# EAGLE design faboy_ble (EAGLE 7.7.0)
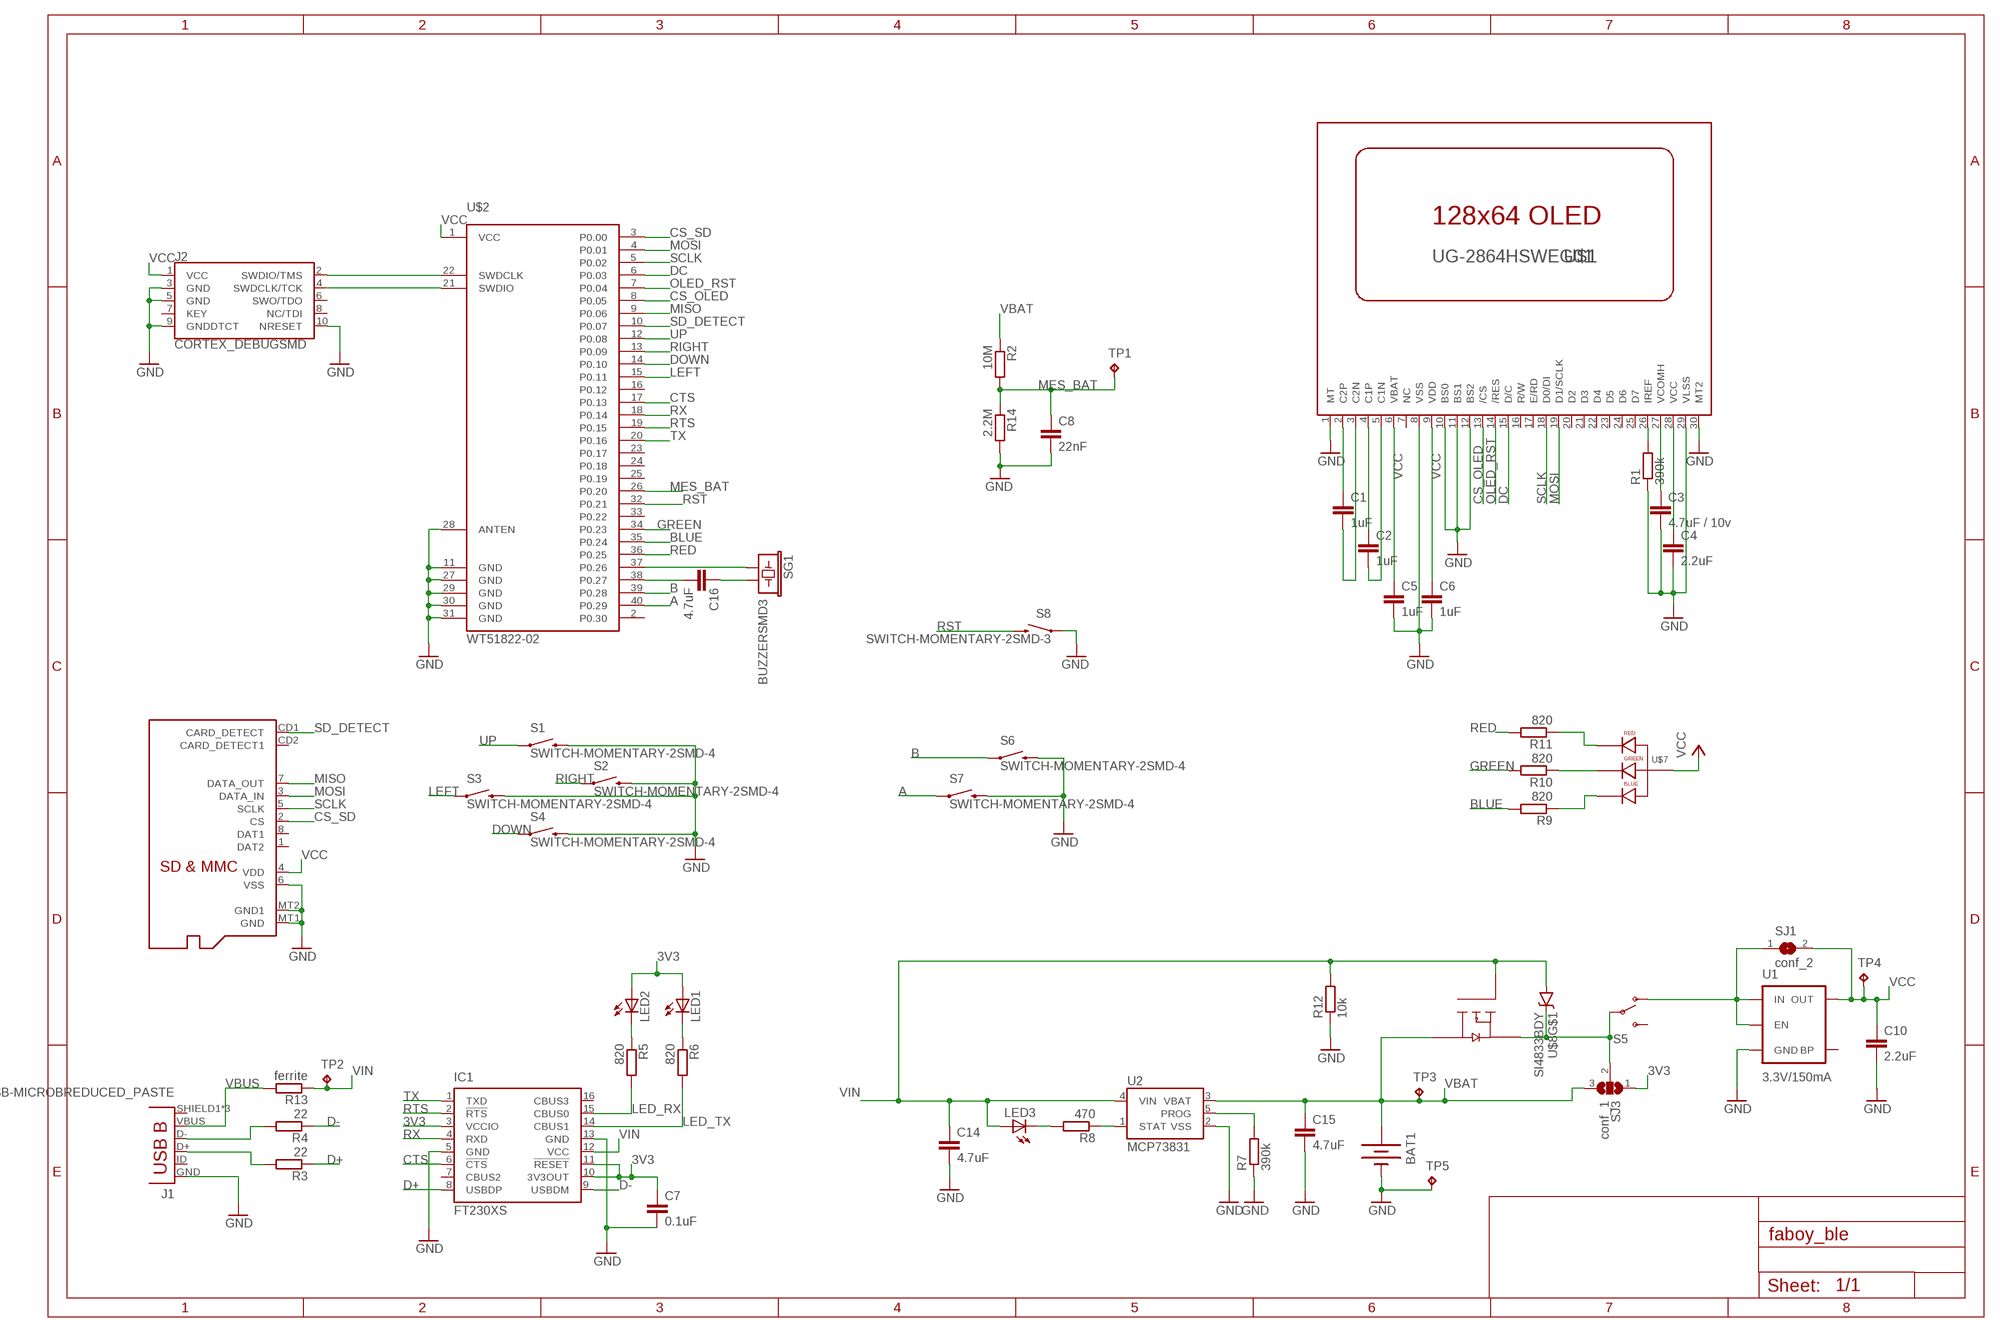
[diagram p0: schematic, sheet 1]

## Parts
BAT1  BATTERY20SMD  [BATTCON_20MM]
C1  1uF  C-EUC0805K  [C0805K]
C2  1uF  C-EUC0805K  [C0805K]
C3  4.7uF / 10v  C-EUC0805K  [C0805K]
C4  2.2uF  C-EUC0805K  [C0805K]
C5  1uF  C-EUC0805K  [C0805K]
C6  1uF  C-EUC0805K  [C0805K]
C7  0.1uF  C-EUC0805K  [C0805K]
C8  22nF  C-EUC0805K  [C0805K]
C10  2.2uF  C-EUC0805K  [C0805K]
C14  4.7uF  C-EUC0805K  [C0805K]
C15  4.7uF  C-EUC0805K  [C0805K]
C16  4.7uF  C-EUC0805K  [C0805K]
IC1  FT230XS  [SSOP16]
J1  USB-MICROBREDUCED_PASTE  [USB-B-MICRO-SMD_V03_RED_PASTE]
J2  CORTEX_DEBUGSMD  [SAMTECH_FTSH-105-01]
LED1  LEDSML0805  [SML0805]
LED2  LEDSML0805  [SML0805]
LED3  LEDSML0805  [SML0805]
R1  390k  R-EU_R0805  [R0805]
R2  10M  R-EU_R0805  [R0805]
R3  22  R-EU_R0805  [R0805]
R4  22  R-EU_R0805  [R0805]
R5  820  R-EU_R0805  [R0805]
R6  820  R-EU_R0805  [R0805]
R7  390k  R-EU_R0805  [R0805]
R8  470  R-EU_R0805  [R0805]
R9  820  R-EU_R0805  [R0805]
R10  820  R-EU_R0805  [R0805]
R11  820  R-EU_R0805  [R0805]
R12  10k  R-EU_R0805  [R0805]
R13  ferrite  R-EU_R0805  [R0805]
R14  2.2M  R-EU_R0805  [R0805]
S1  SWITCH-MOMENTARY-2SMD-4  [TACTILE_SWITCH_TALL]
S2  SWITCH-MOMENTARY-2SMD-4  [TACTILE_SWITCH_TALL]
S3  SWITCH-MOMENTARY-2SMD-4  [TACTILE_SWITCH_TALL]
S4  SWITCH-MOMENTARY-2SMD-4  [TACTILE_SWITCH_TALL]
S5  SWITCH-SPDT-SMD-A  [SWITCH-SPST-SMD-A]
S6  SWITCH-MOMENTARY-2SMD-4  [TACTILE_SWITCH_TALL]
S7  SWITCH-MOMENTARY-2SMD-4  [TACTILE_SWITCH_TALL]
S8  SWITCH-MOMENTARY-2SMD-3  [TACTILE_SWITCH_SMD-3]
SG1  BUZZERSMD3  [BUZZER-CMT1102]
SJ1  conf_2  SJ  [SJ]
SJ3  conf_1  SJ2W  [SJ_2]
TP1  TPB1,27  [B1,27]
TP2  TPB1,27  [B1,27]
TP3  TPB1,27  [B1,27]
TP4  TPB1,27  [B1,27]
TP5  TPB1,27  [B1,27]
U1  3.3V/150mA  V_REG_MIC52053.3V  [SOT23-5]
U2  MCP73831  [SOT23-5]
U$1  UG-2864HSWEG01  [1X30-0.7MM]
U$2  WT51822-02  [WT51822]
U$7  LED-RGB-P-LCC-4  [P-LCC-4-3]
U$8  SI4833BDY  [SO08]
U$9  MICROSD  [MICROSD]

## Nets
3V3: C7.1 IC1.3(VCCIO) IC1.10(3V3OUT) IC1.11(!RESET) LED1.A LED2.A SJ3.1
A: S7.A2 U$2.40(P0.29)
B: S6.A2 U$2.39(P0.28)
BLUE: R9.2 U$2.35(P0.24)
CS_OLED: U$1.13(/CS) U$2.8(P0.05)
CS_SD: U$2.3(P0.00) U$9.2(CS)
CTS: IC1.6(!CTS) U$2.17(P0.13)
D+: IC1.8(USBDP) R3.1
D-: IC1.9(USBDM) R4.1
DC: U$1.15(D/C) U$2.6(P0.03)
DOWN: S4.A2 U$2.14(P0.10)
GND: BAT1.2(-) C3.2 C4.2 C5.2 C6.2 C7.2 C8.2 C10.2 C14.2 C15.2 IC1.5(GND) IC1.13(GND) J1.GND J2.3(GND) J2.5(GND) J2.9(GNDDTCT) J2.10(NRESET) R1.1 R7.1 R12.1 R14.2 S1.B2 S2.B2 S3.B2 S4.B2 S6.B2 S7.B2 S8.1 TP5.TP U1.2(GND) U2.2(VSS) U$1.1(MT) U$1.8(VSS) U$1.10(BS0) U$1.11(BS1) U$1.12(BS2) U$1.29(VLSS) U$1.30(MT2) U$2.11(GND) U$2.27(GND) U$2.28(ANTEN) U$2.29(GND) U$2.30(GND) U$2.31(GND)
GREEN: R10.2 U$2.34(P0.23)
LED_RX: IC1.15(CBUS0) R5.2
LED_TX: IC1.14(CBUS1) R6.2
LEFT: S3.A2 U$2.15(P0.11)
MES_BAT: C8.1 R2.2 R14.1 TP1.TP U$2.26(P0.20)
MISO: U$2.9(P0.06) U$9.7(DATA_OUT)
MOSI: U$1.19(D1/SCLK) U$2.4(P0.01) U$9.3(DATA_IN)
N$1: C1.1 U$1.2(C2P)
N$2: C1.2 U$1.3(C2N)
N$3: C2.1 U$1.4(C1P)
N$4: C2.2 U$1.5(C1N)
N$5: R1.2 U$1.26(IREF)
N$6: R11.1 U$7.1(RED_CATHODE)
N$7: C3.1 U$1.27(VCOMH)
N$8: C4.1 U$1.28(VCC)
N$9: S5.1(O) SJ1.1 U1.1(IN) U1.3(EN)
N$10: C16.2 U$2.38(P0.27)
N$11: C16.1 SG1.2
N$12: J1.D+ R3.2
N$13: J1.D- R4.2
N$17: R8.1 U2.1(STAT)
N$18: LED3.C R8.2
N$19: R7.2 U2.5(PROG)
N$21: SG1.1 U$2.37(P0.26)
N$22: R10.1 U$7.4(GREEN_CATHODE)
N$23: LED2.C R5.1
N$24: R9.1 U$7.3(BLUE_CATHODE)
N$25: LED1.C R6.1
N$28: S5.2(P) SJ3.2 U$8.3(S2) U$8.7(C) U$8.8(C)
OLED_RST: U$1.14(/RES) U$2.7(P0.04)
RED: R11.2 U$2.36(P0.25)
RIGHT: S2.A2 U$2.13(P0.09)
RST: S8.4 U$2.32(P0.21)
RTS: IC1.2(!RTS) U$2.19(P0.15)
RX: IC1.4(RXD) U$2.18(P0.14)
SCLK: U$1.18(D0/DI) U$2.5(P0.02) U$9.5(SCLK)
SD_DETECT: U$2.10(P0.07) U$9.CD1(CARD_DETECT)
SWDCLK: J2.4(SWDCLK/TCK) U$2.21(SWDIO)
SWDIO: J2.2(SWDIO/TMS) U$2.22(SWDCLK)
TX: IC1.1(TXD) U$2.20(P0.16)
UP: S1.A2 U$2.12(P0.08)
VBAT: BAT1.3(+) C15.1 R2.1 SJ3.3 TP3.TP U2.3(VBAT) U$8.5(D2) U$8.6(D2)
VBUS: J1.VBUS R13.2
VCC: C5.1 C6.1 C10.1 J2.1(VCC) SJ1.2 TP4.TP U1.5(OUT) U$1.6(VBAT) U$1.9(VDD) U$2.1(VCC) U$7.2(ANODE) U$9.4(VDD)
VIN: C14.1 IC1.12(VCC) LED3.A R12.2 R13.1 TP2.TP U2.4(VIN) U$8.1(A) U$8.2(A) U$8.4(G2)
VSS: U$9.6(VSS) U$9.MT1(GND) U$9.MT2(GND1) ; supply symbol labelled GND
Unconnected: IC1.7(CBUS2) IC1.16(CBUS3) J1.ID(USBID) J1.SHIELD1(SHIELD) J1.SHIELD2(SHIELD) J1.SHIELD3(SHIELD) J2.6(SWO/TDO) J2.7(KEY) J2.8(NC/TDI) S5.3(S) U1.4(BP) U$1.7(NC) U$1.16(R/W) U$1.17(E/RD) U$1.20(D2) U$1.21(D3) U$1.22(D4) U$1.23(D5) U$1.24(D6) U$1.25(D7) U$2.2(P0.30) U$2.16(P0.12) U$2.23(P0.17) U$2.24(P0.18) U$2.25(P0.19) U$2.33(P0.22) U$9.1(DAT2) U$9.8(DAT1) U$9.CD2(CARD_DETECT1)

## Library data of the parts
BAT1 = SparkFun-Electromechanical:BATTERY: Battery Holders Various common sizes : AA, AAA, 18650 (PRT-12895), 20mm coin cell and 12mm coin cell. 20MM_4LEGS, BATT-10373
C1-C8 C10 C14-C16 = resistor:C-EU: CAPACITOR, European symbol
IC1 = ftdichip:FT230X: USB to BASIC UART IC Auto generated by make-symbol-device-package-bsdl.ulp Rev. 43 Source: Data sheet <http://www.ftdichip.com/Support/Documents/DataSheets/ICs/DS_FT230X.pdf>
J1 = SparkFun-Connectors:USB-MICROB: RED_PASTE version has 70% paste area under D+ D- USBID pins for applications where those pins aren't required, to reduce the likelihood of bridges.; PROD_ID: CONN-11752
J2 = SparkFun-Connectors:CORTEX_DEBUG: Cortex Debug Connector Datasheet <http://infocenter.arm.com/help/topic/com.arm.doc.faqs/attached/13634/cortex_debug_connectors.pdf>
LED1-LED3 = led:LED: LED OSRAM: - CHIPLED LG R971, LG N971, LY N971, LG Q971, LY Q971, LO R971, LY R971 LH N974, LH R974 LS Q976, LO Q976, LY Q976 LO Q996 - Hyper CHIPLED LW Q18S LB Q993, LB Q99A, LB R99A - SideLED LS A670, LO A670, LY A670, LG A670, LP A670 LB A673, LV A673, LT A673, LW A673 LH A674 LY A675 LS A676, LA A676, LO A676, LY A676, LW A676 LS A679, LY A679, LG A679 - Hyper Micro SIDELED® LS Y876, LA Y876, LO Y876, LY Y876 LT Y87S - SmartLED LW L88C, LW L88S LB L89C, LB L89S, LG L890 LS L89K, LO L89K, LY L89K LS L896, LA L896, LO L896, LY L896 - TOPLED LS T670, LO T670, LY T670, LG T670, LP T670 LSG T670, LSP T670, LSY T670, LOP T670, LYG T670 LG T671, LOG T671, LSG T671 LB T673, LV T673, LT T673, LW T673 LH T674 LS T676, LA T676, LO T676, LY T676, LB T676, LH T676, LSB T676, LW T676 LB T67C, LV T67C, LT T67C, LS T67K, LO T67K, LY T67K, LW E67C LS E67B, LA E67B, LO E67B, LY E67B, LB E67C, LV E67C, LT E67C LW T67C LS T679, LY T679, LG T679 LS T770, LO T770, LY T770, LG T770, LP T770 LB T773, LV T773, LT T773, LW T773 LH T774 LS E675, LA E675, LY E675, LS T675 LS T776, LA T776, LO T776, LY T776, LB T776 LHGB T686 LT T68C, LB T68C - Hyper Mini TOPLED® LB M676 - Mini TOPLED Santana® LG M470 LS M47K, LO M47K, LY M47K Source: http://www.osram.convergy.de LUXEON: - LUMILED® LXK2-PW12-R00, LXK2-PW12-S00, LXK2-PW14-U00, LXK2-PW14-V00 LXK2-PM12-R00, LXK2-PM12-S00, LXK2-PM14-U00 LXK2-PE12-Q00, LXK2-PE12-R00, LXK2-PE12-S00, LXK2-PE14-T00, LXK2-PE14-U00 LXK2-PB12-K00, LXK2-PB12-L00, LXK2-PB12-M00, LXK2-PB14-N00, LXK2-PB14-P00, LXK2-PB14-Q00 LXK2-PR12-L00, LXK2-PR12-M00, LXK2-PR14-Q00, LXK2-PR14-R00 LXK2-PD12-Q00, LXK2-PD12-R00, LXK2-PD12-S00 LXK2-PH12-R00, LXK2-PH12-S00 LXK2-PL12-P00, LXK2-PL12-Q00, LXK2-PL12-R00 Source: www.luxeon.com KINGBRIGHT: KA-3528ASYC Source: www.kingbright.com
R1-R14 = resistor:R-EU_: RESISTOR, European symbol
S1-S4 S6 S7 = SparkFun-Electromechanical:SWITCH-MOMENTARY-2: Various NO switches- pushbuttons, reed, etc; PROD_ID: SWCH-11966
S5 = SparkFun-Electromechanical:SWITCH-SPDT: SPDT Switch Simple slide switch, Spark Fun Electronics SKU : COM-00102 DPDT SMT slide switch, AYZ0202, SWCH-08179; PROD_ID: SWCH-10651
S8 = SparkFun-Electromechanical:SWITCH-MOMENTARY-2: Various NO switches- pushbuttons, reed, etc
SG1 = SparkFun-Electromechanical:BUZZER: Buzzer 12mm Spark Fun Electronics SKU : Comp-Buzzer
SJ1 = jumper:SJ: SMD solder JUMPER
SJ3 = jumper:SJ2W: SMD solder JUMPER
TP1-TP5 = testpad:TP: Test pad
U1 = SparkFun-PowerIC:V_REG_MIC5205: V_REG MIC5205 Standard 3.3V, 5V, and Adjustable 150mA LDO voltage regulator in SOT-23 layout. Micrel part MIC5205. BP (by-pass) pin is used to lower output noise with 470pF cap, may be left open. On the adjustable version BP is used to set output.; PROD_ID: VREG-00822
U2 = SparkFun-PowerIC:MCP73831: Miniature single cell, fully integrated Li-Ion, Li-polymer charge management controller http://ww1.microchip.com/downloads/en/DeviceDoc/20001984g.pdf IC-09995; PROD_ID: IC-09995
U$1 = adafruit:UG-2864HSWEG01: UG-2864HSWEG01 OLED display
U$2 = Wireless_Tag:WT51822-02
U$7 = SparkFun-LED:LED-RGB-P-LCC-4
U$8 = SparkFun-DiscreteSemi:SI4833BDY
U$9 = adafruit:MICROSD: Micro-SD / Transflash card holder with SPI pinout For the 3M # 2908-05WB-MG and/or 4UCON #19656 push-push type

## Board
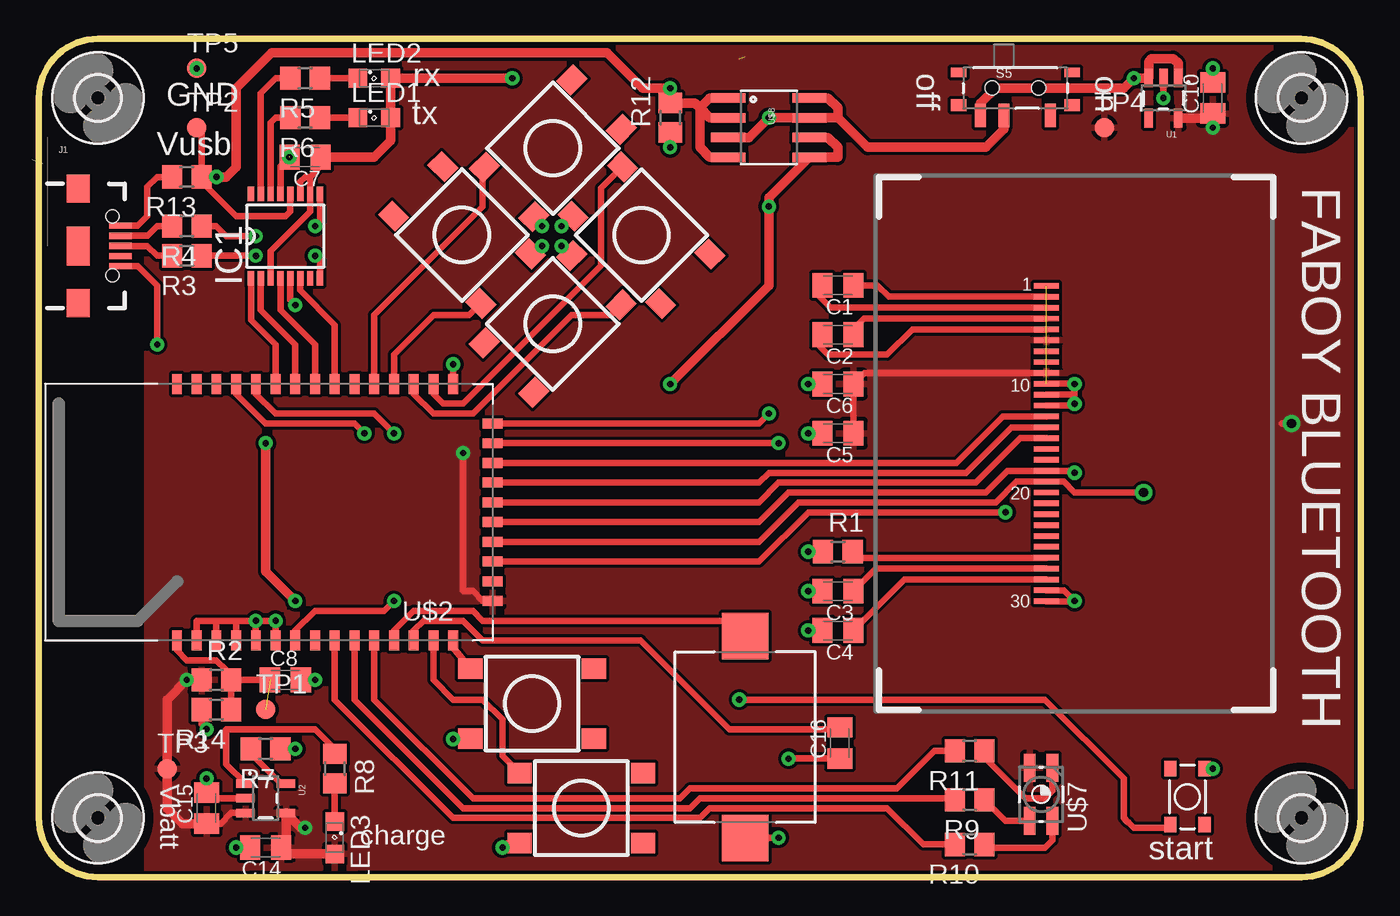
[diagram p1: board, top side]
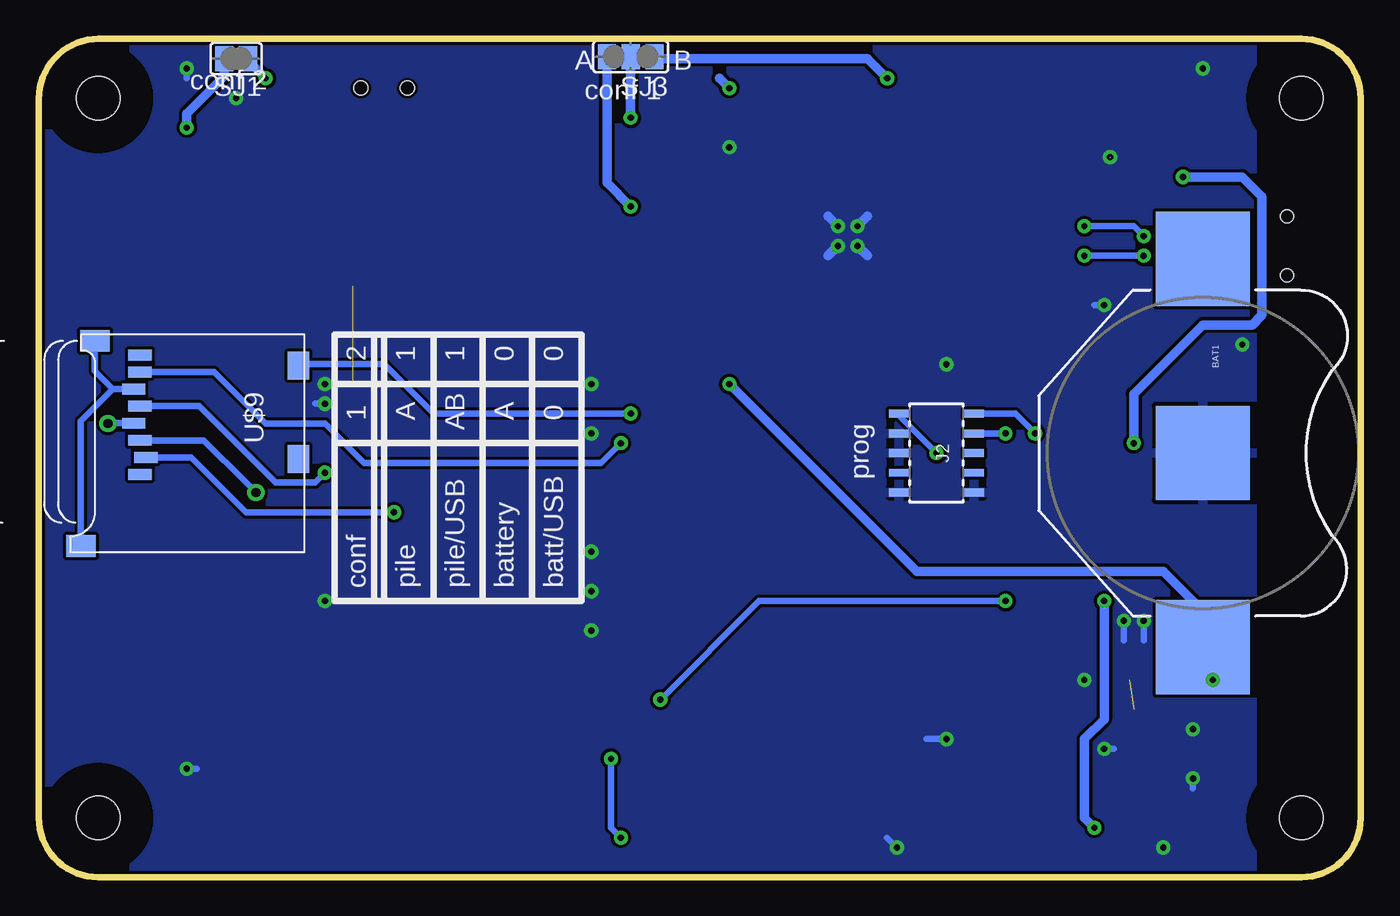
[diagram p2: board, bottom side, seen from below]

Size 85.09 x 53.98 mm. Coordinates in mm from the lower left corner, seen from the top.
Outline: 81.23,53.98 3.81,53.98 arc90 0,50.16 0,3.81 arc90 3.81,0 81.28,0 arc90 85.09,3.81 85.09,50.11 arc90 81.23,53.98
Copper layers (1*16): Top 0.035mm / dielectric 1.5mm / Bottom 0.035mm
Design rules "SparkFun": minimum track width 8mil, minimum drill 20mil, track to track 8mil, track to pad 8mil, pad to pad 8mil, via to via 8mil, smd to smd 8mil, copper to edge 8mil, drill to drill 8mil, minimum pad ring 12mil, minimum via ring 10mil, stop-mask expansion 4mil, vias tented up to drill 20mil, thermal gap 10mil

### Footprints (pad centres in the part's own frame; a part is rotated, then mirrored left to right if it is on the bottom)
BATTCON_20MM = smd 6.07 x 6.07: 1 -12.5,0; 2 0,0; 3 12.5,0
C0805K = smd 1.3 x 1.6: 1 -1,0; 2 1,0
SSOP16 = smd 0.914 x 0.406: 1 -2.718,2.223; 2 -2.718,1.587; 3 -2.718,0.953; 4 -2.718,0.318; 5 -2.718,-0.318; 6 -2.718,-0.953; 7 -2.718,-1.587; 8 -2.718,-2.223; 9 2.718,-2.223; 10 2.718,-1.587; 11 2.718,-0.953; 12 2.718,-0.318; 13 2.718,0.318; 14 2.718,0.953; 15 2.718,1.587; 16 2.718,2.223
USB-B-MICRO-SMD_V03_RED_PASTE = smd 1.45 x 0.4: D+ 2.725,0; D- 2.725,0.65; GND 2.725,-1.3; ID 2.725,-0.65; VBUS 2.725,1.3 | smd 1.5 x 1.8: SHIELD1 0,3.685; SHIELD2 0,-3.685 | smd 1.5 x 2.5: SHIELD3 0,0 | hole 0.85: 2.2,1.9; 2.2,-1.9
SAMTECH_FTSH-105-01 = smd 0.508 x 1.27: 1 -2.54,-2.413; 2 -2.54,2.413; 3 -1.27,-2.413; 4 -1.27,2.413; 5 0,-2.413; 6 0,2.413; 7 1.27,-2.413; 8 1.27,2.413; 9 2.54,-2.413; 10 2.54,2.413
SML0805 = smd 1.2 x 1.2: A 1.05,0; C -1.05,0
R0805 = smd 1.3 x 1.5: 1 -0.95,0; 2 0.95,0
TACTILE_SWITCH_TALL = smd 1.55 x 1.3: A1 -3.975,-2.25; A2 3.975,-2.25; B1 -3.975,2.25; B2 3.975,2.25
SWITCH-SPST-SMD-A = smd 0.7 x 1.5: 1 -2.25,-1.75; 2 -0.75,-1.75; 3 2.25,-1.75 | smd 1 x 0.6: GND1 -3.65,1; GND3 3.65,1 | smd 1 x 0.8: GND2 -3.65,-1.1; GND4 3.65,-1.1 | hole 0.9: -1.5,0; 1.5,0
TACTILE_SWITCH_SMD-3 = smd 1 x 0.8: 1 -1.8,1.1; 2 1.8,1.1; 3 -1.8,-1.1; 4 1.8,-1.1
BUZZER-CMT1102 = smd 3 x 3: 1 -6.5,0; 2 6.5,0
SJ = smd 1.168 x 1.6: 1 -0.762,0; 2 0.762,0
SJ_2 = smd 1.168 x 1.6: 1 -1.524,0; 2 0,0; 3 1.524,0
B1,27 = smd 1.27 x 1.27: TP 0,0
SOT23-5 = smd 0.55 x 1.2: 1 -0.95,-1.3; 2 0,-1.3; 3 0.95,-1.3; 4 0.95,1.3; 5 -0.95,1.3
1X30-0.7MM = smd 0.35 x 1.6: 1 -10.15,0; 2 -9.45,0; 3 -8.75,0; 4 -8.05,0; 5 -7.35,0; 6 -6.65,0; 7 -5.95,0; 8 -5.25,0; 9 -4.55,0; 10 -3.85,0; 11 -3.15,0; 12 -2.45,0; 13 -1.75,0; 14 -1.05,0; 15 -0.35,0; 16 0.35,0; 17 1.05,0; 18 1.75,0; 19 2.45,0; 20 3.15,0; 21 3.85,0; 22 4.55,0; 23 5.25,0; 24 5.95,0; 25 6.65,0; 26 7.35,0; 27 8.05,0; 28 8.75,0; 29 9.45,0; 30 10.15,0
WT51822 = smd 1.27 x 0.635: 1 0,13.97; 2 0,12.7; 3 0,11.43; 4 0,10.16; 5 0,8.89; 6 0,7.62; 7 0,6.35; 8 0,5.08; 9 0,3.81; 10 0,2.54 | smd 0.635 x 1.27: 11 2.54,0; 12 3.81,0; 13 5.08,0; 14 6.35,0; 15 7.62,0; 16 8.89,0; 17 10.16,0; 18 11.43,0; 19 12.7,0; 20 13.97,0; 21 15.24,0; 22 16.51,0; 23 17.78,0; 24 19.05,0; 25 20.32,0; 26 20.32,16.51; 27 19.05,16.51; 28 17.78,16.51; 29 16.51,16.51; 30 15.24,16.51; 31 13.97,16.51; 32 12.7,16.51; 33 11.43,16.51; 34 10.16,16.51; 35 8.89,16.51; 36 7.62,16.51; 37 6.35,16.51; 38 5.08,16.51; 39 3.81,16.51; 40 2.54,16.51
2,8 = hole 2.8: 0,0
P-LCC-4-3 = smd 0.75 x 1.8: 1 0.725,1.7; 2 -0.725,1.7; 3 -0.725,-1.7; 4 0.725,-1.7
SO08 = smd 0.61 x 2.21: 1 -1.905,-2.616; 2 -0.635,-2.616; 3 0.635,-2.616; 4 1.905,-2.616; 5 1.905,2.616; 6 0.635,2.616; 7 -0.635,2.616; 8 -1.905,2.616
MICROSD = smd 0.7 x 1.5: 1 9,-10.64; 2 7.9,-10.24; 3 6.8,-10.64; 4 5.7,-11.04; 5 4.6,-10.64; 6 3.5,-11.04; 7 2.4,-10.64; 8 1.3,-10.64 | smd 1.8 x 1.4: CD1 2,-0.44; CD2 8,-0.44 | smd 1.4 x 1.9: MT1 0.4,-13.54; MT2 13.6,-14.44

### Placement (x,y rotation side)
BAT1  10.16,27.3 270 bottom
C1  51.44,38.1 180 top
C2  51.44,34.92 180 top
C3  51.44,18.41 180 top
C4  51.44,15.88 180 top
C5  51.44,28.57 180 top
C6  51.44,31.75 180 top
C7  17.14,46.35 180 top
C8  15.88,12.7 0 top
C10  75.56,50.16 90 top
C14  14.61,1.91 180 top
C15  10.79,4.45 90 top
C16  51.56,8.64 90 top
IC1  15.88,41.27 90 top
J1  2.54,40.64 0 top
J2  27.3,27.3 270 bottom
LED1  21.59,48.9 0 top
LED2  21.59,51.44 0 top
LED3  19.05,2.54 270 top
R1  51.44,20.95 0 top
R2  11.43,12.7 0 top
R3  9.53,40.01 180 top
R4  9.53,41.91 180 top
R5  17.14,51.44 180 top
R6  17.14,48.9 180 top
R7  14.61,8.26 180 top
R8  19.05,6.99 270 top
R9  59.92,4.98 180 top
R10  59.92,2.11 180 top
R11  59.92,8.13 180 top
R12  40.64,48.9 90 top
R13  9.53,45.09 180 top
R14  11.43,10.79 180 top
S1  38.79,41.33 135 top
S2  33.08,35.62 45 top
S3  33.09,46.93 225 top
S4  27.24,41.34 315 top
S5  62.87,50.8 0 top
S6  34.92,4.45 180 top
S7  31.75,11.18 180 top
S8  73.94,5.18 270 top
SG1  45.47,9.02 270 top
SJ1  72.39,52.7 180 bottom
SJ3  46.99,52.83 180 bottom
TP1  14.61,10.79 0 top
TP2  10.16,48.26 0 top
TP3  8.26,6.99 0 top
TP4  68.58,48.26 0 top
TP5  10.16,52.07 0 top
U1  72.39,50.16 180 top
U2  14.61,5.08 270 top
U$1  64.87,27.91 270 top
U$2  29.21,31.75 180 top
U$3  [2,8]  81.28,50.16 270 top
U$4  [2,8]  81.28,3.81 270 top
U$5  gnd  [2,8]  3.81,50.16 270 top
U$6  [2,8]  3.81,3.81 270 top
U$7  64.52,5.33 0 top
U$8  46.99,48.26 270 top
U$9  67.94,34.92 270 bottom

### Tracks (layer width: path | path; a pad name or v marks a point on that pad's centre or on a via)
3V3  (via drill 0.4)  (1 unrouted)
  Top 0.406: IC1.11 16.83,44.77 17.14,45.09 17.46,45.09 | 17.46,45.09 IC1.10 17.46,42.86 14.92,40.32 IC1.3 | C7.1 18.14,45.77 17.46,45.09
  Top 0.61: C7.1 21.59,46.35 22.64,47.41 LED1.A LED2.A v30.48,51.44
  Bottom 0.61: v30.48,51.44 31.75,52.7 45.09,52.7 45.34,52.45
A
  Top 0.406: S7.A2 26.67,14.79 U$2.40
B
  Top 0.406: S6.A2 29.84,7.8 29.84,10.16 28.57,11.43 26.67,11.43 25.4,12.7 U$2.39
BLUE
  Top 0.406: U$2.35 20.32,11.43 27.3,4.45 41.91,4.45 42.55,5.08 58.87,5.08 R9.2
CS_OLED
  Top 0.406: U$1.13 62.05,29.66 59.05,26.67 U$2.8
CS_SD  (via drill 0.4)
  Top 0.406: U$2.3 46.35,20.32 49.53,23.5 v62.23,23.5
  Bottom 0.406: v62.23,23.5 71.75,23.5 75.28,27.02 U$9.2
CTS
  Top 0.406: IC1.6 16.83,37.78 19.05,35.56 U$2.17
D+  (via drill 0.4)
  Top 0.406: R3.1 v13.97,40.01 | v17.78,40.01 18.1,39.69 IC1.8
  Bottom 0.406: v13.97,40.01 v17.78,40.01
D-  (via drill 0.4)
  Top 0.406: v13.97,41.27 12.06,41.27 11.43,41.91 R4.1 | v17.78,41.91 18.1,42.23 IC1.9
  Bottom 0.406: v13.97,41.27 14.61,41.91 v17.78,41.91
DC
  Top 0.406: U$1.15 63.19,28.27 60.33,25.4 47.62,25.4 46.35,24.13 U$2.6
DOWN
  Top 0.406: U$2.14 22.86,33.66 25.4,36.2 27.71,36.2 S4.A2
GND  (via drill 0.4)  (3 unrouted)
  Top 0.406: IC1.13 15.56,45.77 16.13,46.34 v16.13,46.35 | C15.2 arc90 11.16,5.08 U2.2 11.43,5.08 10.79,5.71 v10.79,6.35 | C4.2 v49.53,15.88 | C3.2 v49.53,18.41 | R1.1 v49.53,20.95 | C5.2 v49.53,28.57 | U1.2 v72.39,50.16 | U$2.11 v26.67,33.02 | J1.GND 6.38,39.34 7.62,38.1 v7.62,34.29 | C14.2 v12.7,1.91 | U$1.29 65.99,18.46 v66.67,17.78 66.66,17.77 U$1.30 | S8.1 v75.56,6.98 v75.56,6.99 | U$1.10 66.66,31.77 v66.67,31.75 66.67,31.11 66.62,31.07 | U$1.12 66.56,30.36 v66.67,30.48 66.67,31.02 66.62,31.07 | U$1.11 66.62,31.07 | C10.2 v75.56,52.07 | C6.2 v49.53,31.75 | S6.B2 30.14,2.19 v29.84,1.91 | S7.B2 26.71,8.93 v26.67,8.89 | R7.1 v16.51,8.26 | R14.2 10.48,9.84 v10.79,9.53 | C8.2 v17.78,12.7 | U$2.31 v15.24,16.51 12.7,16.51 U$2.29 | U$2.30 v13.97,16.51 11.43,16.51 | U$2.27 10.16,16.51 11.43,16.51 | U$2.28 11.43,16.51 | IC1.5 16.19,37.15 v16.51,36.83
  Top 0.61: R12.1 v40.64,46.99 | S4.B2 31.87,40.12 v32.38,40.64 | S3.B2 31.87,42.43 v32.38,41.91 | S1.B2 34.3,42.55 v33.66,41.91 | S2.B2 34.27,40.02 v33.66,40.64
  Bottom 0.406: v66.67,17.78 66.04,17.78 | v75.56,6.99 74.93,6.99 | v66.67,31.75 66.04,31.75 | v66.67,30.48 67.31,30.48 | v75.56,52.07 75.56,51.44 | v49.53,31.75 50.16,31.75 | v29.84,1.91 30.48,2.54 | v26.67,8.89 27.94,8.89 | v16.51,8.26 15.88,8.26 | v10.79,6.35 10.79,5.71 | v15.24,16.51 U$2.31 | v13.97,16.51 U$2.30 | v16.51,36.83 17.14,36.83
  Bottom 0.61: v32.38,40.64 31.75,40.01 | v32.38,41.91 31.75,42.55 | v33.66,41.91 34.29,42.55 | v33.66,40.64 34.29,40.01
  other vias: 10.16,52.07
  pour Bottom: 6.99,53.98 85.09,53.98 85.09,0 6.99,0
GREEN
  Top 0.406: U$2.34 19.05,11.43 26.67,3.81 42.55,3.81 43.18,4.45 54.61,4.45 56.95,2.11 R10.2
LED_RX
  Top 0.406: IC1.15 14.29,50.48 15.24,51.44 R5.2
LED_TX
  Top 0.406: IC1.14 14.92,48.58 15.24,48.9 R6.2
LEFT
  Top 0.406: U$2.15 21.59,36.2 28.57,43.18 28.57,45.6 S3.A2
MES_BAT  (1 unrouted)
  Top 0.406: U$2.26 8.89,14.61 9.53,13.97 11.43,13.97 12.06,13.34 12.06,13.02 R2.2 | R14.1 R2.2 | C8.1 R2.2
MISO  (via drill 0.4)
  Top 0.406: U$2.9 v47.62,27.94
  Bottom 0.406: v47.62,27.94 48.9,26.67 64.14,26.67 66.67,29.21 70.48,29.21 73.8,32.52 U$9.7
MOSI  (via drill 0.6)
  Top 0.406: U$2.4 46.35,21.59 48.9,24.13 61.59,24.13 62.93,25.46 U$1.19 65.97,25.46 66.67,24.77 v71.12,24.77
  Bottom 0.406: U$9.3 74.48,28.12 71.75,25.4 v71.12,24.77
N$1
  Top 0.406: U$1.2 54.71,37.37 53.98,38.1 C1.1
N$2
  Top 0.406: U$1.3 50.97,36.66 50.16,37.47 50.16,37.83 C1.2
N$3
  Top 0.406: U$1.4 53.11,35.97 52.7,35.56 52.7,35.2 C2.1
N$4
  Top 0.406: U$1.5 56.22,35.27 54.61,33.66 50.8,33.66 50.16,34.29 50.16,34.66 C2.2 50.8,34.56
N$5
  Top 0.406: U$1.26 52.77,20.57 R1.2
N$6
  Top 0.406: U$7.1 65.24,5.55 64.77,5.08 63.5,5.08 60.96,7.62 60.96,8.04 R11.1
N$7
  Top 0.406: U$1.27 53.88,19.86 C3.1
N$8
  Top 0.406: U$1.28 55.73,19.16 C4.1
N$9  (via drill 0.4)
  Top 0.61: S5.1 60.62,49.82 61.59,50.8 69.85,50.8 v70.48,51.44 71.41,51.44 U1.3 71.44,52.52 SJ1.1 73.03,52.7 73.34,52.39 U1.1
  Bottom 0.61: SJ1.1 71.63,52.58 v70.48,51.44
N$10
  Top 0.406: U$2.38 24.13,15.88 24.77,16.51 27.3,16.51 28.57,15.24 38.73,15.24 44.45,9.53 51.45,9.53 C16.2
N$11  (via drill 0.4)
  Top 0.406: C16.1 48.28,7.64 v48.26,7.62 | v47.62,2.54 45.49,2.54 SG1.2
  Bottom 0.406: v48.26,7.62 48.26,3.17 v47.62,2.54
N$12
  Top 0.406: J1.D+ 6.99,40.64 7.62,40.01 R3.2
N$13
  Top 0.406: J1.D- 7,41.29 7.62,41.91 R4.2
N$17
  Top 0.406: U2.1 12.06,7.27 12.06,9.53 17.78,9.53 19.05,8.26 R8.1
N$18
  Top 0.406: R8.2 LED3.C
N$19
  Top 0.406: U2.5 15.56,6.03 13.65,7.93 R7.2
N$21
  Top 0.406: U$2.37 22.86,15.88 24.13,17.14 27.94,17.14 28.57,16.51 44.47,16.51 SG1.1
N$22
  Top 0.406: U$7.4 65.24,2.38 64.77,1.91 61.07,1.91 R10.1
N$23
  Top 0.406: R5.1 LED2.C
N$24
  Top 0.406: U$7.3 62.21,3.63 R9.1
N$25
  Top 0.406: R6.1 LED1.C
N$28  (via drill 0.4)
  Top 0.61: S5.2 62.12,48.15 60.96,46.99 53.34,46.99 51.44,48.9 | 51.44,48.9 U$8.7 v46.99,48.9 45.72,47.62 U$8.3 | U$8.8 50.8,50.16 51.44,49.53 51.44,48.9
  Bottom 0.61: SJ3.2 v46.99,48.9
OLED_RST
  Top 0.406: U$1.14 62.62,28.96 59.69,26.04 46.99,26.04 46.35,25.4 U$2.7
RED
  Top 0.406: R11.2 57.66,8.13 55.24,5.71 41.91,5.71 41.27,5.08 27.94,5.08 21.59,11.43 U$2.36
RIGHT
  Top 0.406: U$2.13 24.13,31.11 25.4,29.84 27.94,29.84 34.29,36.2 36.84,36.2 S2.A2
RST  (via drill 0.4)
  Top 0.406: S8.4 72.63,3.17 70.48,3.17 70.17,3.49 70.05,3.61 69.85,3.81 69.85,6.35 64.77,11.43 v45.09,11.43 | U$2.32 16.51,15.88 17.78,17.14 22.23,17.14 v22.86,17.78
  Bottom 0.406: v22.86,17.78 38.73,17.78 v45.09,11.43
RTS
  Top 0.406: IC1.2 14.29,36.51 16.51,34.29 U$2.19
RX
  Top 0.406: IC1.4 15.56,36.51 17.78,34.29 U$2.18
SCLK  (via drill 0.4)
  Top 0.406: U$2.5 46.35,22.86 48.26,24.77 60.96,24.77 62.36,26.16 U$1.18 66.55,26.16 v66.67,26.04
  Bottom 0.406: v66.67,26.04 67.31,25.4 69.85,25.4 74.78,30.32 U$9.5
SD_DETECT  (via drill 0.4)
  Top 0.406: U$2.10 46.35,29.21 v46.99,29.84
  Bottom 0.406: v46.99,29.84 59.69,29.84 62.87,33.02 68.29,33.02 U$9.CD1
SWDCLK  (via drill 0.4)
  Top 0.406: U$2.21 13.97,31.11 15.24,29.84 21.59,29.84 v22.86,28.57
  Bottom 0.406: v22.86,28.57 J2.4
SWDIO  (via drill 0.4)
  Top 0.406: U$2.22 12.7,31.11 14.61,29.21 20.32,29.21 v20.95,28.57
  Bottom 0.406: v20.95,28.57 22.23,29.84 J2.2
TX
  Top 0.406: IC1.1 13.65,35.88 15.24,34.29 U$2.20
UP
  Top 0.406: U$2.12 25.4,31.11 26.04,30.48 27.3,30.48 36.2,39.37 36.2,44.36 S1.A2
VBAT  (via drill 0.4)
  Top 0.406: C15.1 11.7,3.44 12.38,4.13 U2.3
  Top 0.61: C15.1 9.26,3.44 8.26,4.45 TP3.TP 8.26,11.43 v9.53,12.7 R2.1 | U$8.6 50.8,47.62 51.44,46.99 51.44,46.35 U$8.5 46.99,43.74 v46.99,43.18 46.99,38.1 v40.64,31.75
  Bottom 0.61: v9.53,12.7 10.16,13.34 BAT1.3 10.16,17.14 12.7,19.68 28.57,19.68 v40.64,31.75 | v46.99,43.18 48.51,44.7 SJ3.3
  pour Top: 13.34,0 6.99,0 6.99,13.97 13.34,13.97
VBUS
  Top 0.406: J1.VBUS 6.38,41.94 6.99,42.55 6.99,44.45 7.62,45.09 R13.2
VCC  (via drill 0.4, 0.6)
  Top 0.406: U$1.9 53.15,32.47 C6.1 C5.1 | v27.3,27.3 27.3,18.41 27.94,18.41 28.57,17.78 U$2.1 | v80.64,29.21 80.01,29.21
  Top 0.61: U1.5 75.27,48.87 C10.1 v75.56,48.26
  Bottom 0.406: J2.1 29.72,29.72 v27.3,27.3 | U$9.4 80.63,29.23 v80.64,29.21
  Bottom 0.61: SJ1.2 73.15,51.58 C10.1 v75.56,48.26
  pour Top: 6.99,53.98 84.45,53.98 84.45,0.64 6.99,0.64
VIN  (via drill 0.4)
  Top 0.406: IC1.12 16.19,42.86 15.88,42.55 12.7,42.55 10.47,44.77 R13.1 10.47,47.95 TP2.TP
  Top 0.61: LED3.A 15.61,1.49 C14.1 15.9,1.91 U2.4 16.86,3.17 v17.14,3.17 | v11.43,45.09 R13.1 12.06,45.09 12.7,45.72 12.7,50.8 14.99,53.09 36.58,53.09 38.86,50.8 v40.64,50.8 R12.2 42.23,49.84 42.55,49.53 | v14.61,27.94 14.61,19.68 v16.51,17.78 | U$8.1 43.18,50.16 42.55,49.53 | 42.55,49.53 43.18,48.9 U$8.2 | U$8.4 43.18,46.35 42.55,46.99 42.55,49.53
  Bottom 0.61: v11.43,45.09 7.62,45.09 6.35,43.81 6.35,36.2 6.99,35.56 10.16,35.56 14.61,31.11 v14.61,27.94 | v16.51,17.78 16.51,10.16 17.78,8.89 17.78,3.81 v17.14,3.17 | 41.27,51.44 v40.64,50.8
  pour Top: 14.61,0 20.32,0 20.32,4.45 14.61,4.45
VSS
  Bottom 0.406: U$9.MT1 81.48,32.59 80.32,31.43 | 80.32,31.43 U$9.6 | U$9.MT2 82.39,29.36 80.32,31.43

### Text on the board
tPlace: off | on | rx | GND | tx | Vusb | FABOY BLUETOOTH | Vbatt | charge | start
bPlace: B | A | conf 2 | conf 1 | 0 | 0 | 1 | 1 | 2 | 0 | A | AB | A | 1 | prog | batt/USB | battery | pile/USB | pile | conf
200bmp: /Users/mayencourtlouis/Documents/projets/faboy/pcb/qrcode_github.bmp | /Users/mayencourtlouis/Documents/projets/faboy/pcb/qrcode_github.bmp